# Altium schematic sheet Schematic V2.SchDoc
size A
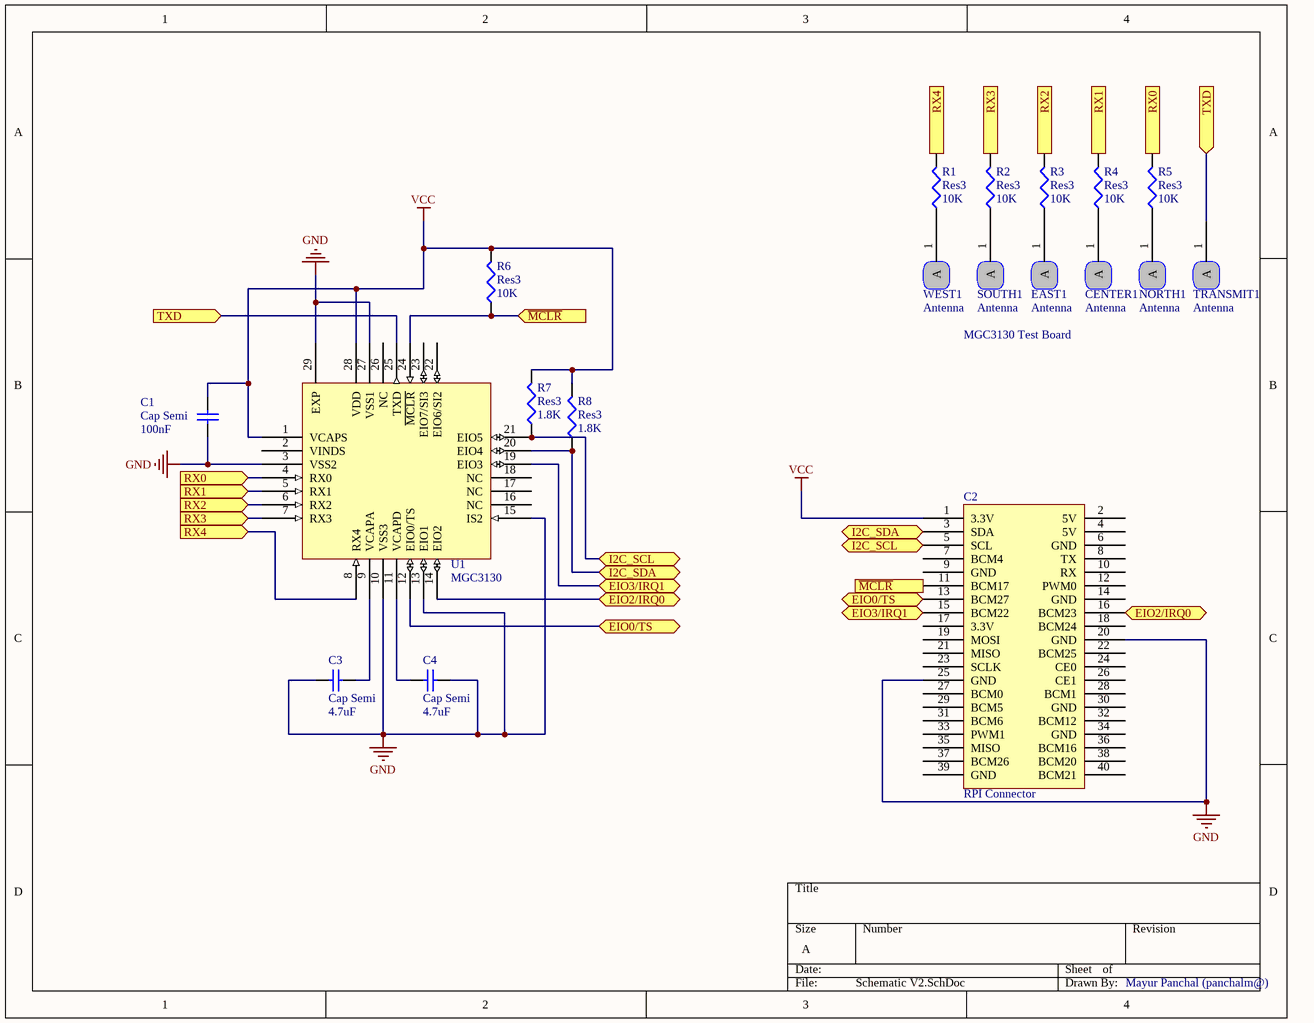
[diagram p0: Schematic V2.SchDoc]

## Parts
C1  Cap Semi  value 100nF  [1608[0603]]
C2  RPI Connector  [40 Pin SMD Header]
C3  Cap Semi  value 4.7uF  [1608[0603]]
C4  Cap Semi  value 4.7uF  [1608[0603]]
CENTER1  Antenna
EAST1  Antenna  [East Electrode]
NORTH1  Antenna  [North Electrode]
R1  Res3  value 10K  [J1-0603]
R2  Res3  value 10K  [J1-0603]
R3  Res3  value 10K  [J1-0603]
R4  Res3  value 10K  [J1-0603]
R5  Res3  value 10K  [J1-0603]
R6  Res3  value 10K  [J1-0603]
R7  Res3  value 1.8K  [J1-0603]
R8  Res3  value 1.8K  [J1-0603]
SOUTH1  Antenna  [South Electrode]
TRANSMIT1  Antenna
U1  MGC3130  [QFN28]
WEST1  Antenna  [West Electrode]

## Ports
EIO0/TS (bidir), EIO2/IRQ0 (bidir), EIO3/IRQ1 (bidir), I2C_SCL (bidir), I2C_SDA (bidir), RX0 (in), RX1 (in), RX2 (in), RX3 (in), RX4 (in), TXD (in), ~{MCLR} (in)

## Nets
GND: C1.1 C2.20(GND) C2.25(GND) C3.1 C4.2 U1.3(VSS2) U1.10(VSS3) U1.13(EIO1) U1.15(IS2) U1.27(VSS1) U1.29(EXP)
VCC: C1.2 C2.1(3.3V) R6.2 R7.2 R8.2 U1.1(VCAPS) U1.28(VDD)
~{MCLR}: C2.11(BCM17) R6.1 U1.24(~{MCLR}) ; port ~{MCLR}
EIO0/TS: C2.13(BCM27) U1.12(EIO0/TS) ; port EIO0/TS
EIO2/IRQ0: C2.16(BCM23) U1.14(EIO2) ; port EIO2/IRQ0
EIO3/IRQ1: C2.15(BCM22) U1.19(EIO3) ; port EIO3/IRQ1
I2C_SCL: C2.5(SCL) R7.1 U1.21(EIO5) ; port I2C_SCL
I2C_SDA: C2.3(SDA) R8.1 U1.20(EIO4) ; port I2C_SDA
RX0: R5.2 U1.4(RX0) ; port RX0
RX1: R4.2 U1.5(RX1) ; port RX1
RX2: R3.2 U1.6(RX2) ; port RX2
RX3: R2.2 U1.7(RX3) ; port RX3
RX4: R1.2 U1.8(RX4) ; port RX4
TXD: TRANSMIT1.1(A) U1.25(TXD) ; port TXD
NetC3_2: C3.2 U1.9(VCAPA)
NetC4_1: C4.1 U1.11(VCAPD)
NetCENTER1_1: CENTER1.1(A) R4.1
NetEAST1_1: EAST1.1(A) R3.1
NetNORTH1_1: NORTH1.1(A) R5.1
NetR1_1: R1.1 WEST1.1(A)
NetR2_1: R2.1 SOUTH1.1(A)

Not connected (* = marked no-connect by the designer): C2 2(5V) 4(5V) 6(GND) 7(BCM4) 8(TX) 9(GND) 10(RX) 12(PWM0) 14(GND) 17(3.3V) 18(BCM24) 19(MOSI) 21(MISO) 22(BCM25) 23(SCLK) 24(CE0) 26(CE1) 27(BCM0) 28(BCM1) 29(BCM5) 30(GND) 31(BCM6) 32(BCM12) 33(PWM1) 34(GND) 35(MISO) 36(BCM16) 37(BCM26) 38(BCM20) 39(GND) 40(BCM21); U1 2(VINDS) 16(NC) 17(NC) 18(NC) 22(EIO6/SI2) 23(EIO7/SI3) 26(NC)

## Notes on the sheet
- MGC3130 Test Board
- Mayur Panchal (panchalm@)

## Library data of the parts
C1 C3 C4 = Cap Semi: Capacitor (Semiconductor SIM Model); Published: 8-Jun-2000; LatestRevisionDate: 29-May-2009; LatestRevisionNote: IPC-7351 Footprint Added.; PackageReference: C1206; Publisher: Altium Limited; PackageDescription: Chip Capacitor
C2 = 40 Pin Header
CENTER1 = Center Antenna
EAST1 = East Antenna
NORTH1 = North Antenna
R1-R8 = Res3: Resistor; Published: 8-Jun-2000; LatestRevisionDate: 29-May-2009; LatestRevisionNote: IPC-7351 Footprint Added.; PackageReference: J1-0603; Publisher: Altium Limited; PackageDescription: Chip Resistor
SOUTH1 = South Antenna
TRANSMIT1 = Transmit Antenna
U1 = MGC3130: Gesture Recognition IC
WEST1 = West Antenna